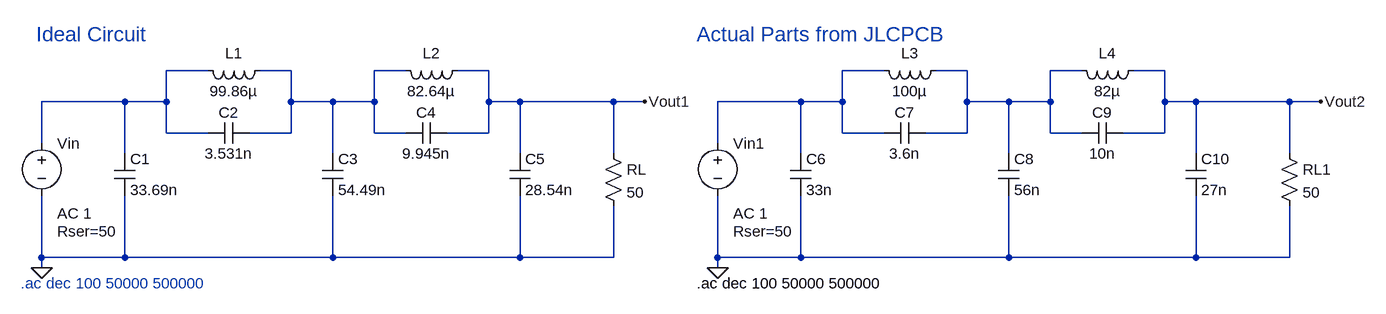
[diagram p0: schematic LPFilter_100kHz_Elliptical.asc]
LPFilter_100kHz_Elliptical.asc, the LTspice schematic file:
Version 4.1
SHEET 1 2068 728
WIRE 272 -128 208 -128
WIRE 400 -128 352 -128
WIRE 576 -128 528 -128
WIRE 704 -128 656 -128
WIRE 1312 -128 1248 -128
WIRE 1440 -128 1392 -128
WIRE 1616 -128 1568 -128
WIRE 1744 -128 1696 -128
WIRE 144 -80 16 -80
WIRE 208 -80 208 -128
WIRE 208 -80 144 -80
WIRE 400 -80 400 -128
WIRE 464 -80 400 -80
WIRE 528 -80 528 -128
WIRE 528 -80 464 -80
WIRE 704 -80 704 -128
WIRE 752 -80 704 -80
WIRE 896 -80 752 -80
WIRE 944 -80 896 -80
WIRE 1184 -80 1056 -80
WIRE 1248 -80 1248 -128
WIRE 1248 -80 1184 -80
WIRE 1440 -80 1440 -128
WIRE 1504 -80 1440 -80
WIRE 1568 -80 1568 -128
WIRE 1568 -80 1504 -80
WIRE 1744 -80 1744 -128
WIRE 1792 -80 1744 -80
WIRE 1936 -80 1792 -80
WIRE 1984 -80 1936 -80
WIRE 208 -32 208 -80
WIRE 272 -32 208 -32
WIRE 400 -32 400 -80
WIRE 400 -32 336 -32
WIRE 528 -32 528 -80
WIRE 576 -32 528 -32
WIRE 704 -32 704 -80
WIRE 704 -32 640 -32
WIRE 1248 -32 1248 -80
WIRE 1312 -32 1248 -32
WIRE 1440 -32 1440 -80
WIRE 1440 -32 1376 -32
WIRE 1568 -32 1568 -80
WIRE 1616 -32 1568 -32
WIRE 1744 -32 1744 -80
WIRE 1744 -32 1680 -32
WIRE 16 -16 16 -80
WIRE 1056 -16 1056 -80
WIRE 144 0 144 -80
WIRE 464 0 464 -80
WIRE 752 0 752 -80
WIRE 896 0 896 -80
WIRE 1184 0 1184 -80
WIRE 1504 0 1504 -80
WIRE 1792 0 1792 -80
WIRE 1936 0 1936 -80
WIRE 16 160 16 64
WIRE 144 160 144 64
WIRE 144 160 16 160
WIRE 464 160 464 64
WIRE 464 160 144 160
WIRE 752 160 752 64
WIRE 752 160 464 160
WIRE 896 160 896 80
WIRE 896 160 752 160
WIRE 1056 160 1056 64
WIRE 1184 160 1184 64
WIRE 1184 160 1056 160
WIRE 1504 160 1504 64
WIRE 1504 160 1184 160
WIRE 1792 160 1792 64
WIRE 1792 160 1504 160
WIRE 1936 160 1936 80
WIRE 1936 160 1792 160
WIRE 16 176 16 160
WIRE 1056 176 1056 160
FLAG 16 176 0
FLAG 1056 176 0
FLAG 944 -80 Vout1
FLAG 1984 -80 Vout2
SYMBOL voltage 16 -32 R0
WINDOW 123 24 124 Left 2
WINDOW 39 24 152 Left 2
SYMATTR Value2 AC 1
SYMATTR SpiceLine Rser=50
SYMATTR InstName Vin
SYMATTR Value ""
SYMBOL cap 128 0 R0
SYMATTR InstName C1
SYMATTR Value 33.69n
SYMBOL cap 336 -48 R90
WINDOW 0 0 32 VBottom 2
WINDOW 3 32 32 VTop 2
SYMATTR InstName C2
SYMATTR Value 3.531n
SYMBOL ind 368 -144 R90
WINDOW 0 5 56 VBottom 2
WINDOW 3 32 56 VTop 2
SYMATTR InstName L1
SYMATTR Value 99.86µ
SYMBOL cap 448 0 R0
SYMATTR InstName C3
SYMATTR Value 54.49n
SYMBOL cap 640 -48 R90
WINDOW 0 0 32 VBottom 2
WINDOW 3 32 32 VTop 2
SYMATTR InstName C4
SYMATTR Value 9.945n
SYMBOL ind 672 -144 R90
WINDOW 0 5 56 VBottom 2
WINDOW 3 32 56 VTop 2
SYMATTR InstName L2
SYMATTR Value 82.64µ
SYMBOL cap 736 0 R0
SYMATTR InstName C5
SYMATTR Value 28.54n
SYMBOL res 880 -16 R0
SYMATTR InstName RL
SYMATTR Value 50
SYMBOL voltage 1056 -32 R0
WINDOW 123 24 124 Left 2
WINDOW 39 24 152 Left 2
SYMATTR Value2 AC 1
SYMATTR SpiceLine Rser=50
SYMATTR InstName Vin1
SYMATTR Value ""
SYMBOL cap 1168 0 R0
SYMATTR InstName C6
SYMATTR Value 33n
SYMBOL cap 1376 -48 R90
WINDOW 0 0 32 VBottom 2
WINDOW 3 32 32 VTop 2
SYMATTR InstName C7
SYMATTR Value 3.6n
SYMBOL ind 1408 -144 R90
WINDOW 0 5 56 VBottom 2
WINDOW 3 32 56 VTop 2
SYMATTR InstName L3
SYMATTR Value 100µ
SYMATTR SpiceLine Rser=0.563
SYMBOL cap 1488 0 R0
SYMATTR InstName C8
SYMATTR Value 56n
SYMBOL cap 1680 -48 R90
WINDOW 0 0 32 VBottom 2
WINDOW 3 32 32 VTop 2
SYMATTR InstName C9
SYMATTR Value 10n
SYMBOL ind 1712 -144 R90
WINDOW 0 5 56 VBottom 2
WINDOW 3 32 56 VTop 2
SYMATTR InstName L4
SYMATTR Value 82µ
SYMATTR SpiceLine Rser=0.16
SYMBOL cap 1776 0 R0
SYMATTR InstName C10
SYMATTR Value 27n
SYMBOL res 1920 -16 R0
SYMATTR InstName RL1
SYMATTR Value 50
TEXT -16 200 Left 2 ;.ac dec 100 50000 500000
TEXT 1024 200 Left 2 !.ac dec 100 50000 500000
TEXT 8 -184 Left 3 ;Ideal Circuit
TEXT 1024 -184 Left 3 ;Actual Parts from JLCPCB

The netlist it stands for:
* LPFilter_100kHz_Elliptical.asc
Vin N001 0 AC 1 Rser=50
C1 N001 0 33.69n
C2 N002 N001 3.531n
L1 N002 N001 99.86µ
C3 N002 0 54.49n
C4 Vout1 N002 9.945n
L2 Vout1 N002 82.64µ
C5 Vout1 0 28.54n
RL Vout1 0 50
Vin1 N003 0 AC 1 Rser=50
C6 N003 0 33n
C7 N004 N003 3.6n
L3 N004 N003 100µ Rser=0.563
C8 N004 0 56n
C9 Vout2 N004 10n
L4 Vout2 N004 82µ Rser=0.16
C10 Vout2 0 27n
RL1 Vout2 0 50
* .ac dec 100 50000 500000
.ac dec 100 50000 500000
* Ideal Circuit
* Actual Parts from JLCPCB
.backanno
.end

* Results of the author's LTspice run, read from the files saved beside the schematic
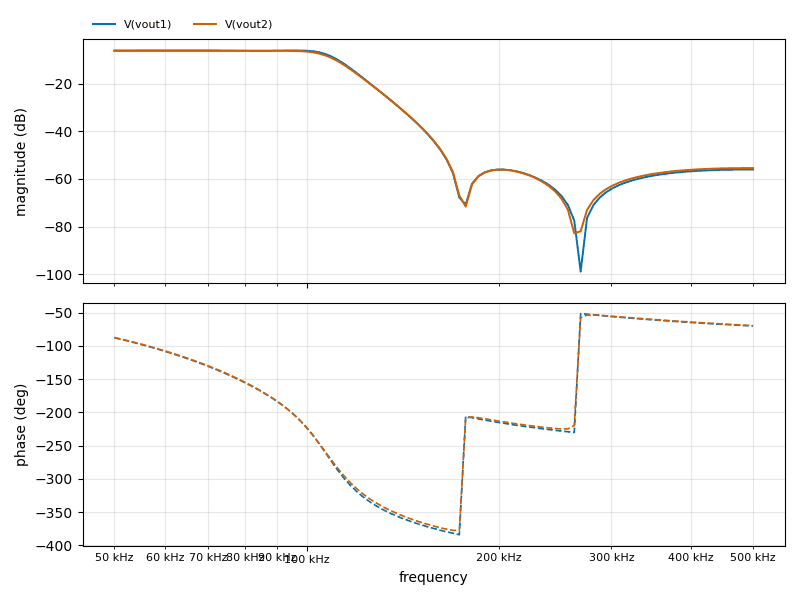
[diagram p1: AC Analysis of LPFilter_100kHz_Elliptical.asc, plotted from the saved traces]
* AC Analysis, 1 run:
*   V(vout1): -6.07 dB at 50 kHz, -56.02 dB at 500 kHz, peak -6.02 dB at 62.95 kHz, 3 dB below the peak at 110.2 kHz
*   V(vout2): -6.17 dB at 50 kHz, -55.45 dB at 500 kHz, peak -6.13 dB at 64.41 kHz, 3 dB below the peak at 109.4 kHz